# Altium schematic sheet LED(0).schdoc
size A4; SheetNumber: 2; SheetTotal: 2; SPICEModelCacheJENUYAPN: <root> / <DocumentId>JENUYAPN</DocumentId> / <CacheFrame Number="0"> / <Model Name="led0" Kind="MDL"> / <Text>*Typ INFRARED GaAs LED: Vf=1.2V Vr=5V If=40mA trr=3uS / *LED Pinout: 1=A, 2=K / .MODEL LED0 D (IS=93.5P RS=84M N=2.63 BV=5 IBV=10U / + CJO=2.97P VJ=.75 M=.333 TT=4.32U)</Text> / </Model> / </CacheFrame> / </root>
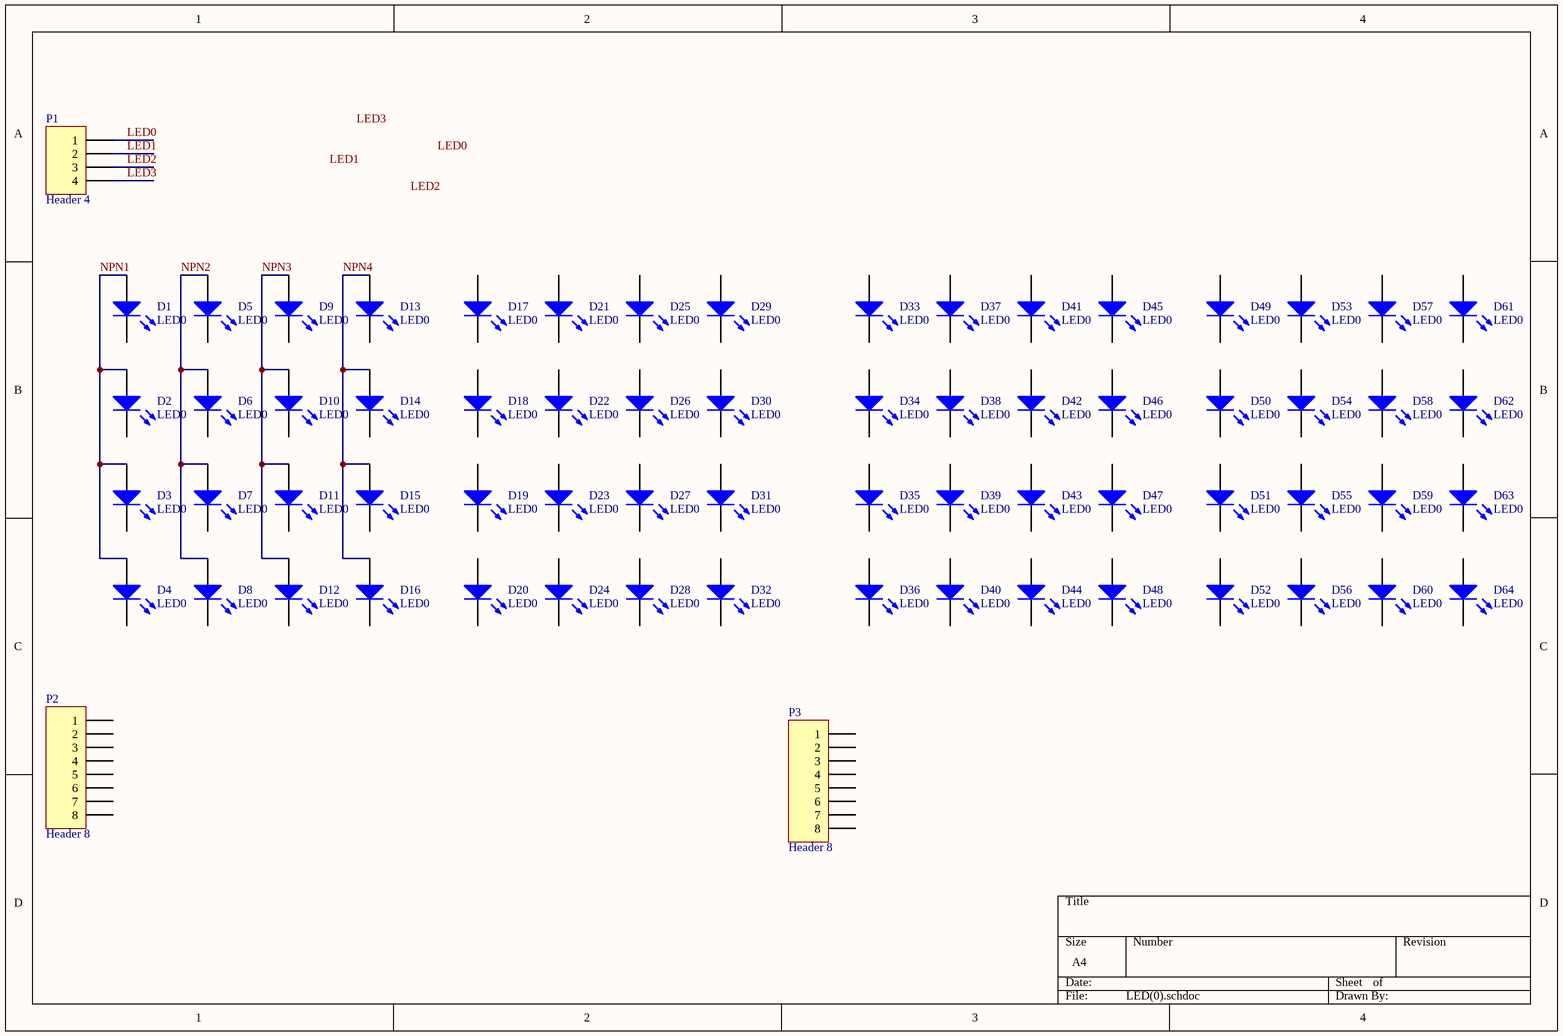
[diagram p0: LED(0).schdoc]

## Parts
D1  LED0  [LED-0]
D2  LED0  [LED-0]
D3  LED0  [LED-0]
D4  LED0  [LED-0]
D5  LED0  [LED-0]
D6  LED0  [LED-0]
D7  LED0  [LED-0]
D8  LED0  [LED-0]
D9  LED0  [LED-0]
D10  LED0  [LED-0]
D11  LED0  [LED-0]
D12  LED0  [LED-0]
D13  LED0  [LED-0]
D14  LED0  [LED-0]
D15  LED0  [LED-0]
D16  LED0  [LED-0]
D17  LED0  [LED-0]
D18  LED0  [LED-0]
D19  LED0  [LED-0]
D20  LED0  [LED-0]
D21  LED0  [LED-0]
D22  LED0  [LED-0]
D23  LED0  [LED-0]
D24  LED0  [LED-0]
D25  LED0  [LED-0]
D26  LED0  [LED-0]
D27  LED0  [LED-0]
D28  LED0  [LED-0]
D29  LED0  [LED-0]
D30  LED0  [LED-0]
D31  LED0  [LED-0]
D32  LED0  [LED-0]
D33  LED0  [LED-0]
D34  LED0  [LED-0]
D35  LED0  [LED-0]
D36  LED0  [LED-0]
D37  LED0  [LED-0]
D38  LED0  [LED-0]
D39  LED0  [LED-0]
D40  LED0  [LED-0]
D41  LED0  [LED-0]
D42  LED0  [LED-0]
D43  LED0  [LED-0]
D44  LED0  [LED-0]
D45  LED0  [LED-0]
D46  LED0  [LED-0]
D47  LED0  [LED-0]
D48  LED0  [LED-0]
D49  LED0  [LED-0]
D50  LED0  [LED-0]
D51  LED0  [LED-0]
D52  LED0  [LED-0]
D53  LED0  [LED-0]
D54  LED0  [LED-0]
D55  LED0  [LED-0]
D56  LED0  [LED-0]
D57  LED0  [LED-0]
D58  LED0  [LED-0]
D59  LED0  [LED-0]
D60  LED0  [LED-0]
D61  LED0  [LED-0]
D62  LED0  [LED-0]
D63  LED0  [LED-0]
D64  LED0  [LED-0]
P1  Header 4  [HDR1X4]
P2  Header 8  [HDR1X8]
P3  Header 8  [HDR1X8]

## Nets
LED0: P1.1
LED1: P1.2
LED2: P1.3
LED3: P1.4
NPN1: D1.1(A) D2.1(A) D3.1(A) D4.1(A)
NPN2: D5.1(A) D6.1(A) D7.1(A) D8.1(A)
NPN3: D9.1(A) D10.1(A) D11.1(A) D12.1(A)
NPN4: D13.1(A) D14.1(A) D15.1(A) D16.1(A)

Not connected (* = marked no-connect by the designer): D1 2(K); D2 2(K); D3 2(K); D4 2(K); D5 2(K); D6 2(K); D7 2(K); D8 2(K); D9 2(K); D10 2(K); D11 2(K); D12 2(K); D13 2(K); D14 2(K); D15 2(K); D16 2(K); D17 1(A) 2(K); D18 1(A) 2(K); D19 1(A) 2(K); D20 1(A) 2(K); D21 1(A) 2(K); D22 1(A) 2(K); D23 1(A) 2(K); D24 1(A) 2(K); D25 1(A) 2(K); D26 1(A) 2(K); D27 1(A) 2(K); D28 1(A) 2(K); D29 1(A) 2(K); D30 1(A) 2(K); D31 1(A) 2(K); D32 1(A) 2(K); D33 1(A) 2(K); D34 1(A) 2(K); D35 1(A) 2(K); D36 1(A) 2(K); D37 1(A) 2(K); D38 1(A) 2(K); D39 1(A) 2(K); D40 1(A) 2(K); D41 1(A) 2(K); D42 1(A) 2(K); D43 1(A) 2(K); D44 1(A) 2(K); D45 1(A) 2(K); D46 1(A) 2(K); D47 1(A) 2(K); D48 1(A) 2(K); D49 1(A) 2(K); D50 1(A) 2(K); D51 1(A) 2(K); D52 1(A) 2(K); D53 1(A) 2(K); D54 1(A) 2(K); D55 1(A) 2(K); D56 1(A) 2(K); D57 1(A) 2(K); D58 1(A) 2(K); D59 1(A) 2(K); D60 1(A) 2(K); D61 1(A) 2(K); D62 1(A) 2(K); D63 1(A) 2(K); D64 1(A) 2(K); P2 1 2 3 4 5 6 7 8; P3 1 2 3 4 5 6 7 8

## Notes on the sheet
- Labels drawn without touching a wire or pin: LED0, LED1, LED2, LED3

## Library data of the parts
D1-D64 = LED0: Typical INFRARED GaAs LED; Published: 8-Jun-2000; LatestRevisionDate: 08-Jul-2005; LatestRevisionNote: Mech Layer 1 removed.; PackageReference: LED-0; Publisher: Altium Limited; PackageDescription: LED; 2 Leads
P1 = Header 4: Header, 4-Pin; LatestRevisionDate: 17-Jul-2002; LatestRevisionNote: Re-released for DXP Platform.; Publisher: Altium Limited
P2 P3 = Header 8: Header, 8-Pin; LatestRevisionDate: 17-Jul-2002; LatestRevisionNote: Re-released for DXP Platform.; Publisher: Altium Limited